# Altium project Robo_Tank (DESKTOP-IFENSDK's conflicted copy 2022-05-19).PrjPcb
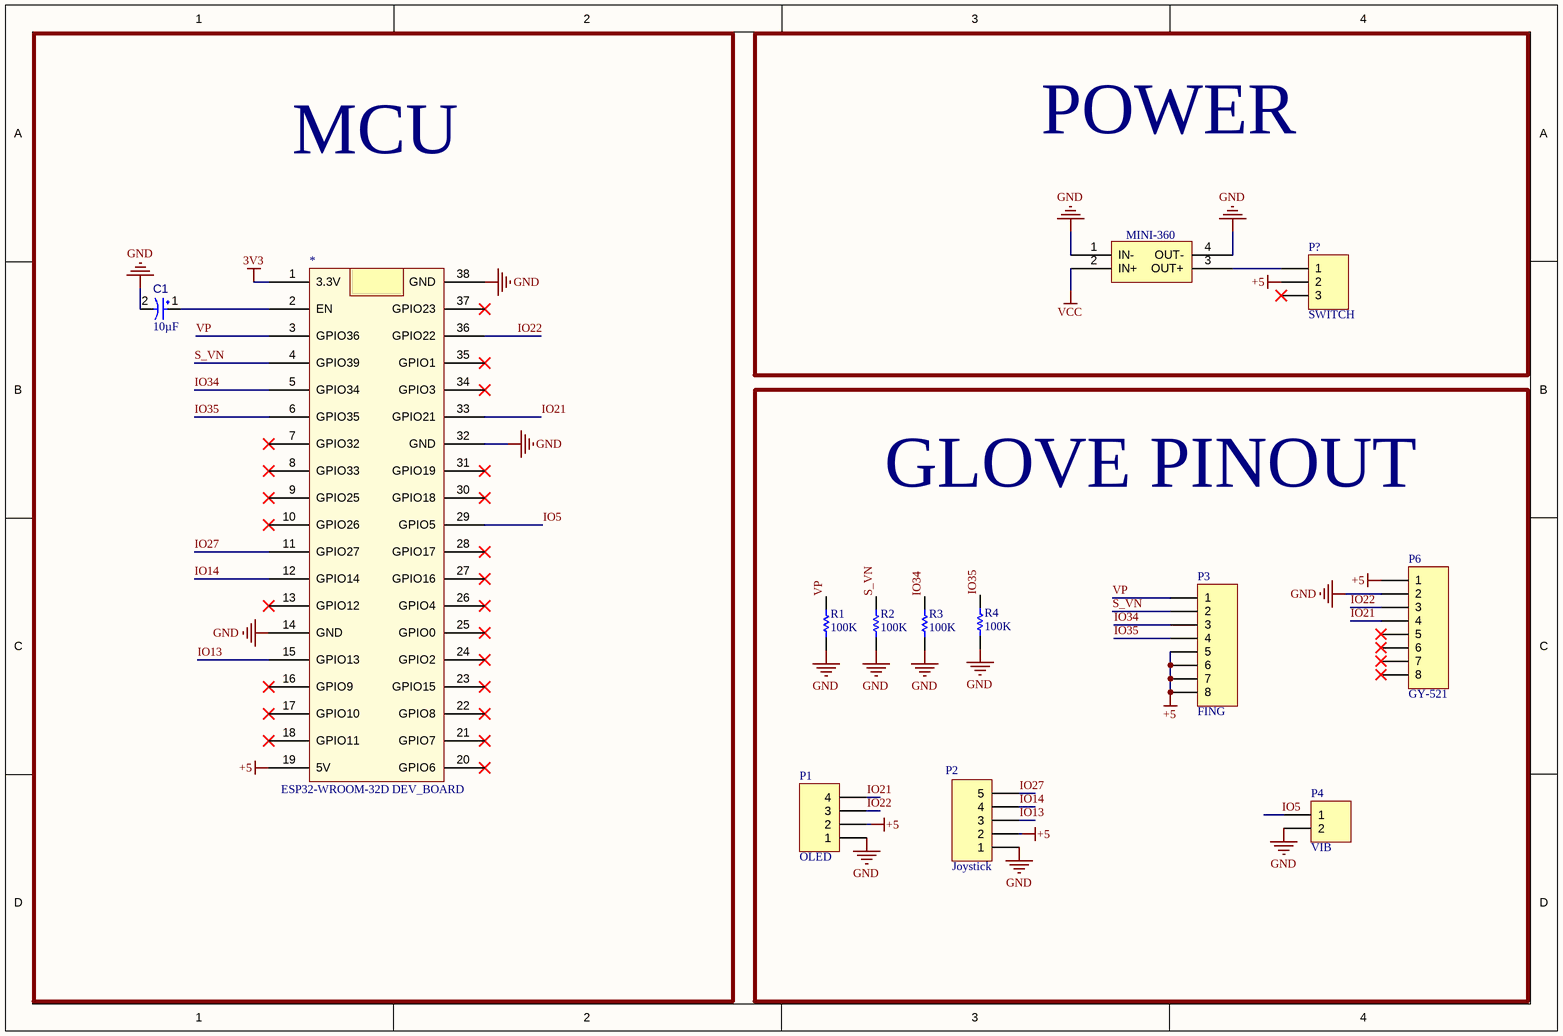
[diagram p0: Tank_Schematic.SchDoc]
1 sheet, 13 parts. Net scope: global (net labels, ports and power ports of the same name join across sheets).
Board file: TANK_PCB.PcbDoc

## Sheet Tank_Schematic.SchDoc
size A4; SheetNumber: 1; SheetTotal: 1

### Parts
*  ESP32-WROOM-32D DEV_BOARD  [PCBComponent_1]
C1  value 10µF  [CAPPR55-200-1100X500X1200]  (hidden comment: ECA1HM100)
MINI-360  MINI-360  [MINI-360]  (value not drawn)
P1  OLED  [HDR1X4]
P2  Joystick  [HDR1X5]
P3  FING  [HDR1X8]
P4  VIB  [HDR1X2]
P6  GY-521  [HDR1X8]
P?  SWITCH  [HDR1X3]
R1  value 100K  [AXIAL-0.3]
R2  value 100K  [AXIAL-0.3]
R3  value 100K  [AXIAL-0.3]
R4  value 100K  [AXIAL-0.3]

### Blocks framed on the sheet
MCU: * C1
POWER: MINI-360 P?
GLOVE PINOUT: P1-P4 P6 R1-R4

### Nets
3V3: *.1(3.3V)
+5: *.19(5V) P1.2 P2.2 P3.5 P3.6 P3.7 P3.8 P6.1 P?.2
GND: *.14(GND) *.32(GND) *.38(GND) C1.2 MINI-360.1(IN-) MINI-360.4(OUT-) P1.1 P2.1 P4.2 P6.2 R1.1 R2.1 R3.1 R4.1
VCC: MINI-360.2(IN+)
IO5: *.29(GPIO5) P4.1
IO13: *.15(GPIO13) P2.3
IO14: *.12(GPIO14) P2.4
IO21: *.33(GPIO21) P1.4 P6.4
IO22: *.36(GPIO22) P1.3 P6.3
IO27: *.11(GPIO27) P2.5
IO34: *.5(GPIO34) P3.3 R3.2
IO35: *.6(GPIO35) P3.4 R4.2
S_VN: *.4(GPIO39) P3.2 R2.2
VP: *.3(GPIO36) P3.1 R1.2
Net*_2: *.2(EN) C1.1
NetMINI-360_3: MINI-360.3(OUT+) P?.1

Not connected (* = marked no-connect by the designer): * 7(GPIO32)* 8(GPIO33)* 9(GPIO25)* 10(GPIO26)* 13(GPIO12)* 16(GPIO9)* 17(GPIO10)* 18(GPIO11)* 20(GPIO6)* 21(GPIO7)* 22(GPIO8)* 23(GPIO15)* 24(GPIO2)* 25(GPIO0)* 26(GPIO4)* 27(GPIO16)* 28(GPIO17)* 30(GPIO18)* 31(GPIO19)* 34(GPIO3)* 35(GPIO1)* 37(GPIO23)*; P6 5* 6* 7* 8*; P? 3*

### Notes on the sheet
- DWG. NO.
- REV.
- SHT.
- REVISION
- DESCRIPTION
- DATE
- APPROVED
- THIS DOCUMENT AND THE DATA DISCLOSED HEREIN OR HEREWITH IS THE PROPERTY OF ALTIUM LIMITED AND MAY BE FREELY DISTRIBUTED IN WHOLE. NO RIGHTS ARE RESERVED OR EXPRESS OR IMPLIED WARANTEE GIVEN.
- ENG:
- DSN:
- APPROVALS
- PROJECT
- DOCUMENT REVISION:
- DESIGN ITEM:
- CHK:
- BOM:
- REFERENCE DOCUMENTS
- PROJECT REVISION:
- TITLE
- FAB DWG:
- PCB DWG:
- ASSY DWG:
- SCALE:
- SIZE
- C
- CAGE CODE
- FILE NAME
- DWG NO.
- SHEET
- OF
- REV

### Library data of the parts
C1 = CMP-001-00025-7: Aluminum Electrolytic Capacitor, 10 uF, +/- 20%, 50 V, -40 to 85 degC, 2-Pin THD, RoHS, Bulk; Manufacturer: Panasonic; Ripple Current (AC): 65mA; Voltage Rating: 50V; Mounting Technology: TH; RoHS Compliant: True; Capacitor Type: Electrolytic; Datasheet Version: Rev. 05, 10/2016; Min Operating Temperature: -40°C; Packaging: Bulk; Ripple Current: 65mA; Tolerance: 20%; Max Operating Temperature: 85°C; Datasheet URL: https://industrial.panasonic.com/cdbs/www-data/pdf/RDF0000/ABA0000C1218.pdf; Lead Pitch: 2mm; Pins: 2; Diameter: 5mm; Manufacturer URL: http://www.panasonic.com/; Package Reference: CAPPR55-200-1100X500X1200; Package Description: 2-Pin Radial Lead, Dia 5 mm, Height 12 mm; Case/Package: Radial; Package Quantity: 200
MINI-360 = CMP-004-000006-1: Design Item ID: MINI-360; Source: MINI-360.SchLib
P1 = Header 4: Header, 4-Pin; LatestRevisionDate: 17-Jul-2002; LatestRevisionNote: Re-released for DXP Platform.; Publisher: Altium Limited
P2 = Header 5: Header, 5-Pin; LatestRevisionDate: 17-Jul-2002; LatestRevisionNote: Re-released for DXP Platform.; Publisher: Altium Limited
P3 P6 = Header 8: Header, 8-Pin; LatestRevisionDate: 17-Jul-2002; LatestRevisionNote: Re-released for DXP Platform.; Publisher: Altium Limited
P4 = Header 2: Header, 2-Pin; LatestRevisionDate: 17-Jul-2002; LatestRevisionNote: Re-released for DXP Platform.; Publisher: Altium Limited
P? = Header 3: Header, 3-Pin; LatestRevisionDate: 17-Jul-2002; LatestRevisionNote: Re-released for DXP Platform.; Publisher: Altium Limited
R1-R4 = Res1: Resistor; Published: 8-Jun-2000; LatestRevisionDate: 17-Jul-2002; LatestRevisionNote: Re-released for DXP Platform.; PackageReference: AXIAL-0.3; Publisher: Altium Limited; PackageDescription: Axial Device, Thru-Hole; 2 Leads; 0.3 in Pin Spacing